# Altium schematic sheet AT Guard Simple RTC.SchDoc
size A4
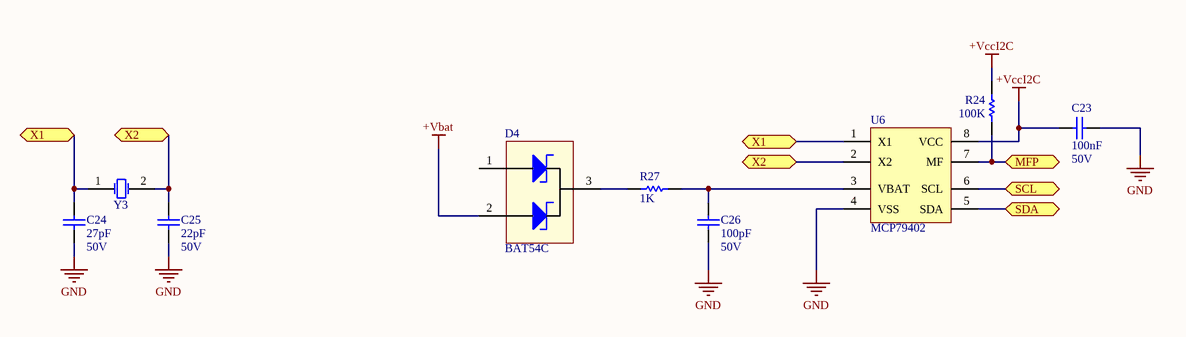
[diagram p0: AT Guard Simple RTC.SchDoc]

## Parts
C23  value 100nF  Voltage: 50V  [3-0603_L]  (hidden comment: Cap)
C24  value 27pF  Voltage: 50V  [3-0603_L]  (hidden comment: Cap)
C25  value 22pF  Voltage: 50V  [3-0603_L]  (hidden comment: Cap)
C26  value 100pF  Voltage: 50V  [3-0603_L]  (hidden comment: Cap)
D4  BAT54C  [SOT23_N]
R24  value 100K  [3-0603_L]  (hidden comment: Res1)
R27  value 1K  [3-0603_L]  (hidden comment: Res1)
U6  MCP79402  [TSSOP-ST8_M]
Y3  XTAL_SMT  [32768 SMT 2.1x6.2mm Crystal]  (value not drawn)

## Ports
MFP (bidir), SCL (bidir), SDA (bidir), X1, X2

## Nets
+Vbat: D4.2(K2)
+VccI2C: C23.1 R24.1 U6.8(VCC)
GND: C23.2 C24.1 C25.1 C26.1 U6.4(VSS)
MFP: R24.2 U6.7(MF) ; port MFP
SCL: U6.6(SCL) ; port SCL
SDA: U6.5(SDA) ; port SDA
X1: C24.2 U6.1(X1) Y3.1(OSC1) ; port X1
X2: C25.2 U6.2(X2) Y3.2(OSC2) ; port X2
NetC26_2: C26.2 R27.2 U6.3(VBAT)
NetD4_3: D4.3(A) R27.1

Not connected (* = marked no-connect by the designer): D4 1(K1)

## Library data of the parts
C23-C26 = Cap: Capacitor; Published: 8-Jun-2000; Revision: July-2002: Re-released for DXP Platform.; Publisher: Altium Limited
D4 = BAT54C: 2x200 mA Shottky Rectifier; Published: 8-Jun-2000; LatestRevisionDate: 17-Jul-2002; LatestRevisionNote: Re-released for DXP Platform.; DatasheetDocument: 1998; PackageDocument: Aug-1999; PackageReference: DO-41; Publisher: Altium Limited; Code_JEDEC: DO-204-AL; ComponentLink1Description: Manufacturer Link; ComponentLink1URL: http://www.fairchildsemi.com/; ComponentLink2Description: Datasheet; ComponentLink2URL: http://www.fairchildsemi.com/ds/1N%2F1N4001.pdf
R24 R27 = Res1: Resistor; Published: 8-Jun-2000; LatestRevisionDate: 17-Jul-2002; LatestRevisionNote: Re-released for DXP Platform.; PackageReference: AXIAL-0.3; Publisher: Altium Limited
U6 = MCP79402: MCP79402 RTC,I2C; Published: 29-Jan-2009; DatasheetVersion: revE, Mar-2007; PackageVersion: revAW, Oct-2008; PackageReference: SOIJ-SM8; Publisher: Altium Limited; PackageDescription: 8-Lead Plastic Small Outline (SM) - Medium, 5.28 mm Body [SOIJ]; ComponentLink1Description: Manufacturer Link; ComponentLink1URL: http://www.microchip.com; ComponentLink2Description: Datasheet; ComponentLink2URL: http://ww1.microchip.com/downloads/en/DeviceDoc/21941E.pdf; ComponentLink3Description: Packaging Specification; ComponentLink3URL: http://ww1.microchip.com/downloads/en/PackagingSpec/00049AW.pdf
Y3 = XTAL_SMT: Crystal Oscillator; Published: 8-Jun-2000; LatestRevisionDate: 17-Jul-2002; LatestRevisionNote: Re-released for DXP Platform.; PackageReference: R38; Publisher: Altium Limited